# Altium schematic sheet RFswitch.SchDoc
size A4; SheetNumber: 6; SheetTotal: 8
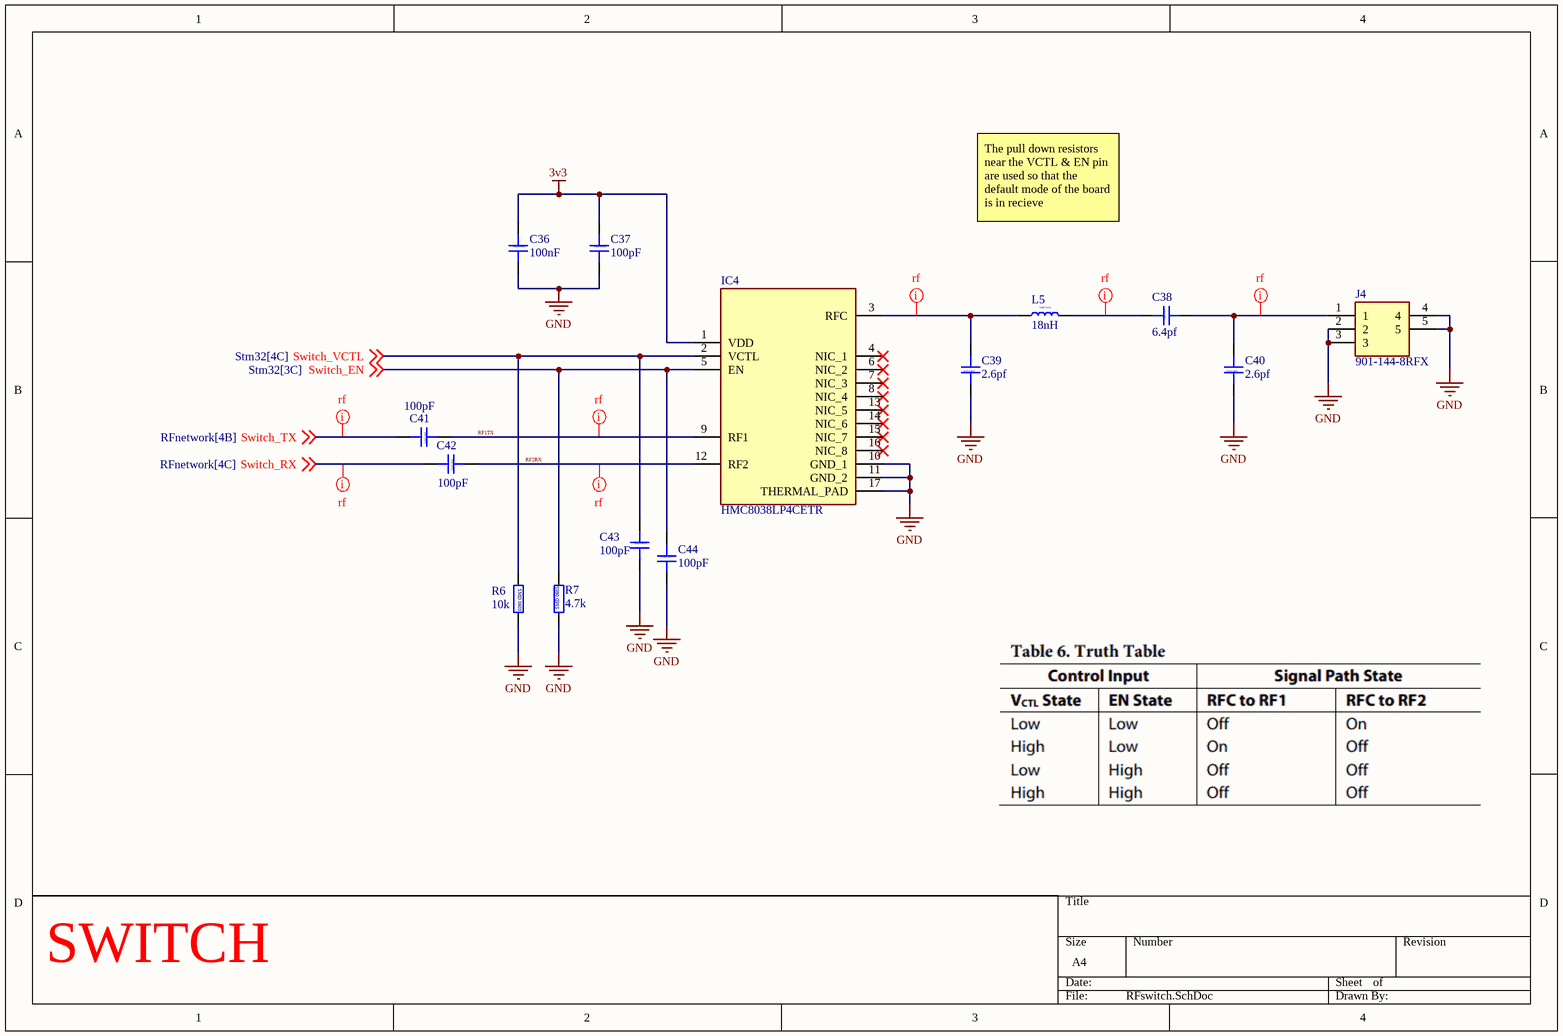
[diagram p0: RFswitch.SchDoc]

## Parts
C36  100nF  [CAP_0603]
C37  100pF  [CAP_0603]
C38  6.4pf  [CAP_0402]
C39  2.6pf  [CAP_0402]
C40  2.6pf  [CAP_0402]
C41  100pF  [CAP_0603]
C42  100pF  [CAP_0603]
C43  100pF  [CAP_0603]
C44  100pF  [CAP_0603]
IC4  HMC8038LP4CETR  [QFN65P400X400X90-17N-D]
J4  901-144-8RFX  [9011448RFX]
L5  18nH  [IND_0402]
R6  10k  [RES_0603]
R7  4.7k  [RES_0603]

## Nets
3v3: C36.1 C37.1 IC4.1(VDD)
GND: C36.2 C37.2 C39.1 C40.1 C43.2 C44.2 IC4.10(GND_1) IC4.11(GND_2) IC4.17(THERMAL_PAD) J4.2 J4.3 J4.4 J4.5 R6.2 R7.1
RF1TX: C41.1 IC4.9(RF1)
RF2RX: C42.1 IC4.12(RF2)
Switch_EN: C44.1 IC4.5(EN) R7.2 ; off-sheet Switch_EN
Switch_RX: C42.2 ; off-sheet Switch_RX
Switch_TX: C41.2 ; off-sheet Switch_TX
Switch_VCTL: C43.1 IC4.2(VCTL) R6.1 ; off-sheet Switch_VCTL
NetC38_1: C38.1 L5.2
NetC38_2: C38.2 C40.2 J4.1
NetC39_2: C39.2 IC4.3(RFC) L5.1

Not connected (* = marked no-connect by the designer): IC4 4(NIC_1)* 6(NIC_2)* 7(NIC_3)* 8(NIC_4)* 13(NIC_5)* 14(NIC_6)* 15(NIC_7)* 16(NIC_8)*

## Layout directives
net class rf: NetC38_1, NetC38_2, NetC39_2, RF1TX, RF2RX, Switch_RX, Switch_TX

## Notes on the sheet
- The pull down resistors near the VCTL & EN pin are used so that the default mode of the board is in recieve
- SWITCH
- (in symbol Capacitor-SMD-0402) SMD 0402
- (in symbol Capacitor-SMD-0603) SMD 0603
- (in symbol Inductor-SMD-RF-0402) SMD 0402
- (in symbol Resistor-SMD-0603) SMD 0603

## Library data of the parts
C36 C37 C41-C44 = Capacitor-SMD-0603: Capacitor SMD 0603 RATED
C38-C40 = Capacitor-SMD-0402: Capacitor SMD 0402 RATED
IC4 = HMC8038LP4CETR: Integrated Circuit; Manufacturer_Name: Analog Devices; Datasheet Link: https://pt.mouser.com/datasheet/2/609/HMC8038W-2956082.pdf; Height: 0.9mm; Manufacturer_Part_Number: HMC8038LP4CETR; Mouser Part Number: 584-HMC8038LP4CETR; Mouser Price/Stock: https://www.mouser.co.uk/ProductDetail/Analog-Devices/HMC8038LP4CETR?qs=JeIcUl65ClBZnat%2FltI6ww%3D%3D; Arrow Part Number: HMC8038LP4CETR; Arrow Price/Stock: https://www.arrow.com/en/products/hmc8038lp4cetr/analog-devices?region=nac
J4 = 901-144-8RFX: Connector; Manufacturer_Name: Amphenol; Description: AMPHENOL RF - 901-144-8RFX - RF / Coaxial Connector; Datasheet Link: https://componentsearchengine.com/Datasheets/1/901-144-8RFX.pdf; Height: 9.53mm; Manufacturer_Part_Number: 901-144-8RFX; Mouser Part Number: 523-901-144-8RFX; Mouser Price/Stock: https://www.mouser.co.uk/ProductDetail/Amphenol-RF/901-144-8RFX?qs=jpOL8GWAqat%252BbPjbt8toTg%3D%3D; Arrow Part Number: 901-144-8RFX; Arrow Price/Stock: https://www.arrow.com/en/products/901-144-8rfx/amphenol-rf?region=europe
L5 = Inductor-SMD-RF-0402: Inductor SMD 0402
R6 R7 = Resistor-SMD-0603: Resistor SMD 0603 RATED